# Altium project B219_BMD-340_carrier_small.PrjPcb
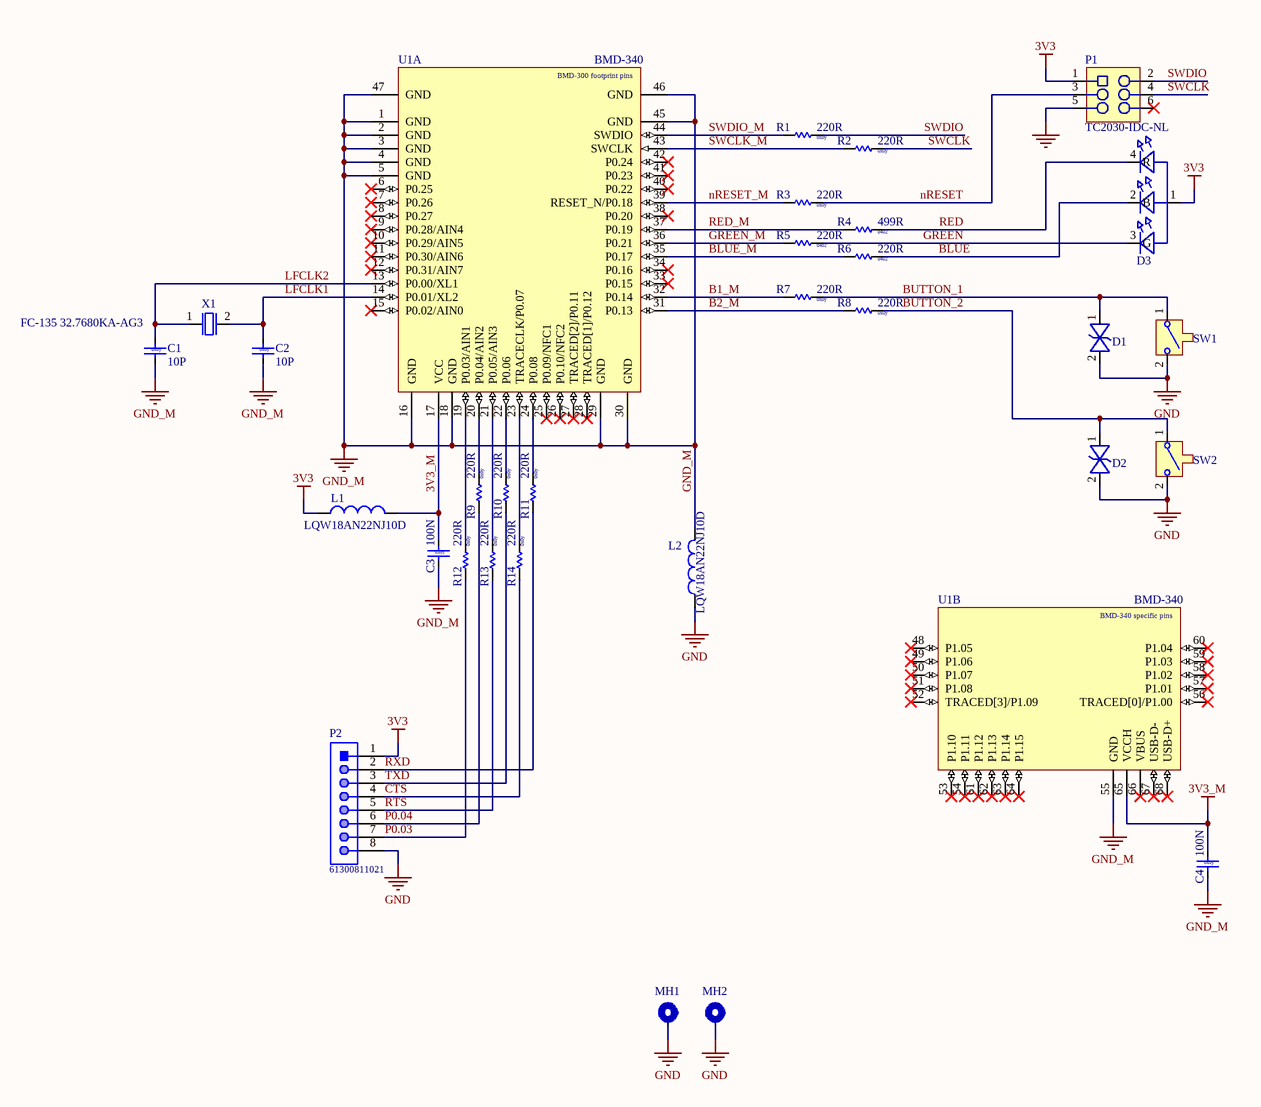
[diagram p0: B219.SchDoc]
GlobalClientName: u-blox; GlobalProjectLink: www.u-blox.com; GlobalProjectName: TE_SUP_ANT; GlobalProjectRevision: A; GlobalProjectTeam: u-blox AG; GlobalReleaseDate: 2020-10-23; PCBDocNum: B219; PCBName: B219 BMD-340 CS; ProjectEngineer: BREC; ReleaseBy1: BREC; ReleaseBy2: -; ReleaseBy3: -; ReleaseDate1: 2020-10-23; ReleaseDate2: -; ReleaseDate3: -; ReleaseDesc1: Initial Release; ReleaseDesc2: -; ReleaseDesc3: -; ReleaseRev1: A; ReleaseRev2: -; ReleaseRev3: -; SchDocNum: B219; SchSheetTotal: 1
1 sheet, 33 parts. Net scope: global (net labels, ports and power ports of the same name join across sheets).
Board file: B219.PcbDoc

## Sheet B219.SchDoc: Sheet Name
size B; Website: www.rigado.com; SheetTitle: Sheet Title; DrawnBy: Your Name; SheetNumber: 1; SheetTotal: X; SheetSize: B

### Parts
(Parts that share a designator on the sheet are numbered #1, #2 ... from top to bottom, then left to right.)
?#1  (no value)  (graphical)
?#2  (no value)  (graphical)
C1  value 10P  Size: 0x0y  [Cap 0402]
C2  value 10P  Size: 0x0y  [Cap 0402]
C3  value 100N  Size: 0x0y  [Cap 0402]
C4  value 100N  Size: 0x0y  [Cap 0402]
D1  (no value)  [SOD-923]
D2  (no value)  [SOD-923]
D3  (no value)  [4-PLCC]
L1  LQW18AN22NJ10D  [INDC1608X100X30LL20T10]
L2  LQW18AN22NJ10D  [INDC1608X100X30LL20T10]
MH1  MH_M1.5DNP  [MH_M1.5]  (value not drawn)
MH2  MH_M1.5DNP  [MH_M1.5]  (value not drawn)
P1  TC2030-IDC-NLDNP  [TC2030-IDC-NL]  (value not drawn)
P2  61300811021  [61300811021]
R1  value 220R  Size: 0x0y  [RES 0402 HD]
R2  value 220R  Size: 0x0y  [RES 0402 HD]
R3  value 220R  Size: 0x0y  [RES 0402 HD]
R4  value 499R  Size: 0402  [RES 0402 HD]
R5  value 220R  Size: 0402  [RES 0402 HD]
R6  value 220R  Size: 0402  [RES 0402 HD]
R7  value 220R  Size: 0x0y  [RES 0402 HD]
R8  value 220R  Size: 0x0y  [RES 0402 HD]
R9  value 220R  Size: 0x0y  [RES 0402 HD]
R10  value 220R  Size: 0x0y  [RES 0402 HD]
R11  value 220R  Size: 0x0y  [RES 0402 HD]
R12  value 220R  Size: 0x0y  [RES 0402 HD]
R13  value 220R  Size: 0x0y  [RES 0402 HD]
R14  value 220R  Size: 0x0y  [RES 0402 HD]
SW1  (no value)  [B3U-1000P]
SW2  (no value)  [B3U-1000P]
U1  (no value)  [BMD_LGA68S_1500X1020X190_PCB]  (parts A,B of 2)
X1  Manufacturer P/N: FC-135 32.7680KA-AG3  [XTAL_3215]

### Nets
3V3: D3.1(A) L1.1 P1.1 P2.1
3V3_M: C3.1 C4.1 L1.2 U1.17(VCC) U1.65(VCCH)
GND: D1.2 D2.2 L2.1 MH1.1 MH2.1 P1.5 P2.8 SW1.2 SW2.2
GND_M: C1.2 C2.2 C3.2 C4.2 L2.2 U1.1(GND) U1.2(GND) U1.3(GND) U1.4(GND) U1.5(GND) U1.16(GND) U1.18(GND) U1.29(GND) U1.30(GND) U1.45(GND) U1.46(GND) U1.47(GND) U1.55(GND)
B1_M: R7.1 U1.32(P0.14)
B2_M: R8.1 U1.31(P0.13)
BLUE: D3.2(B) R6.2
BLUE_M: R6.1 U1.35(P0.17)
BUTTON_1: D1.1 R7.2 SW1.1
BUTTON_2: D2.1 R8.2 SW2.1
CTS: P2.4 R14.1
GREEN: D3.3(G) R5.2
GREEN_M: R5.1 U1.36(P0.21)
LFCLK1: C2.1 U1.14(P0.01/XL2) X1.2
LFCLK2: C1.1 U1.13(P0.00/XL1) X1.1
nRESET: P1.3 R3.2
nRESET_M: R3.1 U1.39(RESET_N/P0.18)
P0.03: P2.7 R12.1
P0.04: P2.6 R9.1
RED: D3.4(R) R4.2
RED_M: R4.1 U1.37(P0.19)
RTS: P2.5 R13.1
RXD: P2.2 R11.1
SWCLK: P1.4 R2.2
SWCLK_M: R2.1 U1.43(SWCLK)
SWDIO: P1.2 R1.2
SWDIO_M: R1.1 U1.44(SWDIO)
TXD: P2.3 R10.1
NetR9_2: R9.2 U1.20(P0.04/AIN2)
NetR10_2: R10.2 U1.22(P0.06)
NetR11_2: R11.2 U1.24(P0.08)
NetR12_2: R12.2 U1.19(P0.03/AIN1)
NetR13_2: R13.2 U1.21(P0.05/AIN3)
NetR14_2: R14.2 U1.23(TRACECLK/P0.07)

Not connected (* = marked no-connect by the designer): P1 6*; U1 6(P0.25)* 7(P0.26)* 8(P0.27)* 9(P0.28/AIN4)* 10(P0.29/AIN5)* 11(P0.30/AIN6)* 12(P0.31/AIN7)* 15(P0.02/AIN0)* 25(P0.09/NFC1)* 26(P0.10/NFC2)* 27(TRACED[2]/P0.11)* 28(TRACED[1]/P0.12)* 33(P0.15)* 34(P0.16)* 38(P0.20)* 40(P0.22)* 41(P0.23)* 42(P0.24)* 48(P1.05)* 49(P1.06)* 50(P1.07)* 51(P1.08)* 52(TRACED[3]/P1.09)* 53(P1.10)* 54(P1.11)* 56(TRACED[0]/P1.00)* 57(P1.01)* 58(P1.02)* 59(P1.03)* 60(P1.04)* 61(P1.12)* 62(P1.13)* 63(P1.14)* 64(P1.15)* 66(VBUS)* 67(USB-D-)* 68(USB-D+)*

### Notes on the sheet
- Rev.
- Description
- Revision
- Date
- By
- Prepared By
- Revision:
- CONFIDENTIAL
- Page:
- (in symbol BMD-340, part A) BMD-300 footprint pins
- (in symbol BMD-340, part B) BMD-340 specific pins

### Library data of the parts
?#1 = Top_Revision_Block: Release Revision History Block
?#2 = Top_Title_Block: Top level schematic title block for top level sheet
C1 C2 = UBXH01-0004114: CAP CER COG 0402; Manufacturer: Murata Manufacturing Company, Ltd.; Manufacturer P/N: GRM1555C1H100CZ01; Tolerance: 5%; Max Voltage: 25.0V; Max Current: None; Editor: martin.frauchiger; Env: ROHS; Permitted Use: Volume Products; Perferred: PREF; Mfg P/N Status: Obsolete; Mfg P/N Split: 0; Mfg P/N Released: Yes; Part Number: UBXH01-0004114; Max Power: None; Min Operating Temp: None; Max Operating Temp: None; Part Type: Capacitor; Released by: martin.frauchiger; Release Data: 2005-09-01 15:36:53; Single Source: None; Automotive: None; Critical: None; UBX Wiki: https://wiki.u-blox.com/bin/view/Operations/PartDetails?index=5225; RefDes: C; Mfg P/N Datasheet: None; Manufacturer 2: None; Manufacturer P/N 2: None; Mfg P/N Status 2: None; Mfg P/N Split 2: None; Mfg P/N Released 2: None; Mfg P/N Datasheet 2: None; Manufacturer 3: None; Manufacturer P/N 3: None; Mfg P/N Status 3: None; Mfg P/N Split 3: None; Mfg P/N Released 3: None; Mfg P/N Datasheet 3: None
C3 C4 = UBXH01-2021002: CAP CER X5R 0402; Manufacturer: Samsung Electro-Mechanics; Manufacturer P/N: CL05A104KP5NNN; Tolerance: 10%; Max Voltage: 10.0V; Max Current: None; Editor: roland.rust; Env: GREEN; Permitted Use: Volume Products; Perferred: PREF; Mfg P/N Status: Active; Mfg P/N Split: 0; Mfg P/N Released: Yes; Part Number: UBXH01-2021002; Max Power: None; Min Operating Temp: None; Max Operating Temp: None; Part Type: Capacitor; Released by: roland.rust; Release Data: 2005-07-22 13:59:44; Single Source: None; Automotive: None; Critical: None; UBX Wiki: https://wiki.u-blox.com/bin/view/Operations/PartDetails?index=5759; RefDes: C; Mfg P/N Datasheet: https://wiki.u-blox.com/bin/view/Generic/Docs/DocumentSummary?index=28113; Manufacturer 2: None; Manufacturer P/N 2: None; Mfg P/N Status 2: None; Mfg P/N Split 2: None; Mfg P/N Released 2: None; Mfg P/N Datasheet 2: None; Manufacturer 3: None; Manufacturer P/N 3: None; Mfg P/N Status 3: None; Mfg P/N Split 3: None; Mfg P/N Released 3: None; Mfg P/N Datasheet 3: None
D1 D2 = 110-00019: Diode, ESD9B, 3.3V, ST5G, SOD-923; Part Name: Diode TVS 3.3V SOD-923; Manufacturer: ON Semiconductor; Manufacturer P/N: ESD9B3.3ST5G; Item_Phase: Production; Body Size: 0.8mm x 0.6mm; Component Mounting Type: SMT; Diode Type: TVS; Use in new designs: Yes; Part Number: 110-00019; Part_Type: Diode; Revision: 0A; Supplier 1: Arrow; Supplier Part Number 1: ESD9B3.3ST5G; Arena Link: https://app.bom.com/a/4M5DJQ9Q9SR7DV4H?v=spec.summary; Height: 0.4mm; MFG Package: SOD-923; Package Type: SOD; Pins: 2; Voltage: 3.3V
D3 = 115-00011: LED, RGB Diffused SMT, PLCC4 4 Pin; Part Name: LED RGB SMT 2mm x 2mm; Manufacturer: Cree, Inc.; Manufacturer P/N: CLMVB-FKA-CFHEHLCBB7a363; Item_Phase: Production; Body Size: 2.0mm x 2.0mm; Current: 20mA Red, 10mA Green, 10mA, Blue; Number of Circuits: 3; Use in new designs: Yes; Vf: 2V Red, 3V Green, 3V Blue; Voltage: 5V; Part Number: 115-00011; Part_Type: LED; Revision: 0A; Supplier 1: Mouser; Supplier Part Number 1: 941-CLMVBFKACFHEHLCB; Arena Link: https://app.bom.com/a/UCV39GZGZIHY581D?v=spec.summary; Color: RGB; Component Mounting Type: SMT; Height: 1mm; MFG Package: PLCC4; Mounting Type: Vertical; Package Type: Custom; Pins: 4
L1 L2 = CMP-2000-06600-1: Chip Inductor, 22 nH, +/-5%, 640 mA, -55 to 125 degC, 0603 (1608 Metric), RoHS, Tape and Reel; Manufacturer: Murata; Frequency - Self Resonant: 3.2GHz; DC Resistance (DCR): 99mOhmMax; Online Catalog: LQWSeries; Frequency - Test: 100MHz; Material - Core: Non-Magnetic; Q @ Freq: 42@250MHz; Tolerance: ±5%; Shielding: Unshielded; Current Rating: 640mA; Type: Wirewound; Inductance: 22nH; Other Names: 490-6876-1; Product Training Modules: InductorProductsChipRFInductors; Category: Inductors,Coils,Chokes; Package Reference: 0603; Package Description: 2-Pin Surface Mount Device, Body 1.6 x 0.8 mm; Packaging: CutTape(CT); Series: LQW18A_10; Mounting Type: SurfaceMount; Datasheet Version: 11/2011; Size / Dimension: 0.063"Lx0.031"W(1.60mmx0.80mm); Manufacturer URL: http://www.murata.com/; Mounting Technology: SurfaceMount; Family: FixedInductors; Operating Temperature: -55°C~125°C; Height - Seated (Max): 0.039"(1.00mm); Package / Case: 0603(1608Metric); Standard Package: 1; Datasheet URL: http://search.murata.co.jp/Ceramy/image/img/PDF/ENG/L0075S0080LQW18A_10.pdf
MH1 MH2 = MH_M1.5: 1.5M screw mounting hole, plated; Added By: Jeremy D; Part Number: MH_M1.5; Size: 3.4mm x 3.4mm; Height: 0mm; Type: Mounting Hole; DNP: DNP; Added Date: 7/9/2015
P1 = TC2030-IDC-NL: CON PADS FOR CBL PLUG-OF-NAILS 6-PIN NO LEGS; Manufacturer: TAG Connect; Added By: Paul B; Manufacturer P/N: TC2030-IDC-NL; Part Number: TC2030-IDC-NL; Size: 6.731mm x 12.446mm; Height: 0; DNP: DNP; Added Date: 4/22/2015
P2 = CMP-1502-01075-1: THT Angled Pin Header WR-PHD, Pitch 2.54 mm, Single Row, 8 pins; Manufacturer: Wurth Electronics; Pin Number: 8; Rated Current: 3A; Working Voltage: 250VAC; Withstanding Voltage: 500VAC; Gender: Male; Contact Resistance: 20mOhm; Pitch: 2.54mm; Part Number: 61300811021; Publisher: WurthElektronik; Manufacturer URL: http://www.we-online.de; Row Number: Single; Datasheet URL: https://katalog.we-online.de/em/datasheet/6130xx11021.pdf; Orientation: Angled; Operating Temperature: -40to105degC; Mounting Technology: THT; Package Reference: 61300811021; Packaging: Bag; Manufacturer Part Number: 61300811021
R1-R3 R7-R14 = UBXH18-0008033: RES THICK FILM CHIP 0402; Manufacturer: YAGEO; Manufacturer P/N: 2322_705_87221_L; Tolerance: 5%; Max Voltage: None; Max Power: 100mW; Editor: roland.rust; Env: ROHS; Permitted Use: Volume Products; Perferred: PREF; Mfg P/N Status: NRND; Mfg P/N Split: 0; Mfg P/N Released: Yes; Part Number: UBXH18-0008033; Max Current: None; Min Operating Temp: None; Max Operating Temp: None; Part Type: Resistor; Released by: roland.rust; Release Data: 2009-04-24 14:36:39; Single Source: None; Automotive: None; Critical: None; UBX Wiki: https://wiki.u-blox.com/bin/view/Operations/PartDetails?index=6914; RefDes: R; Mfg P/N Datasheet: None; Manufacturer 2: None; Manufacturer P/N 2: None; Mfg P/N Status 2: None; Mfg P/N Split 2: None; Mfg P/N Released 2: None; Mfg P/N Datasheet 2: None; Manufacturer 3: None; Manufacturer P/N 3: None; Mfg P/N Status 3: None; Mfg P/N Split 3: None; Mfg P/N Released 3: None; Mfg P/N Datasheet 3: None
R4 = 180-00031: Resistor, 499ohm, 1%, 1/16W, 0402; Part Name: RES SMD 499 OHM 1% 1/16W 0402; Manufacturer: Rohm Semiconductor; Manufacturer P/N: MCR01MRTF4990; Item_Phase: Production; Component Mounting Type: SMT; Tolerance: +/- 1%; Use in new designs: Yes; Part Number: 180-00031; Part_Type: Resistor; Supplier 1: Digi-Key; Supplier Part Number 1: RHM499CDCT-ND; Manufacturer 2: Samsung Electro-Mechanics America, Inc; Manufacturer P/N 2: RC1005F4990CS; Arena Link: https://app.bom.com/a/Q8RZ5CVCVEDU1SS5?v=spec.summary; Height: 0.4mm; Pins: 2; Power: 1/16W; Revision: 0D; Supplier 2: Digi-Key; Supplier Part Number 2: 1276-3992-1-ND; Alternate Footprint Ref: RES 0402
R5 R6 = 180-00098: Resistor, 220ohm, 5%, 1/16W, 0402.; Part Name: RES SMD 220 OHM 5% 1/16W 0402; Manufacturer: Panasonic Electronic Components; Manufacturer P/N: ERJ-2GEJ221X; Item_Phase: Production; Component Mounting Type: SMT; Tolerance: +/- 5%; Use in new designs: Yes; Part Number: 180-00098; Part_Type: Resistor; Supplier 1: Digi-Key; Supplier Part Number 1: P220JCT-ND; Arena Link: https://app.bom.com/a/8Q9HNUDUDWVBJC30?v=spec.summary; Pins: 2; Power: 1/16W; Revision: 0C; Manufacturer 2: Samsung Electro-Mechanics America, Inc; Manufacturer P/N 2: RC1005J221CS; Supplier 2: Digi-Key; Supplier Part Number 2: 1276-4360-1-ND; Alternate Footprint Ref: RES 0402; Height: 0.4mm
SW1 SW2 = 135-00007: Button, Momentary SPST-NO, 0.05A, 12V, 3mm x 2.5mm; Part Name: SWITCH TACTILE SPST-NO 0.05A 12V; Manufacturer: Omron Electronics Inc-EMC Div; Item_Phase: Production; Component Mounting Type: SMT; Current: 50mA; Switch/Button Circuit: SPST; Switch/Button Function: Off-Mom; Use in new designs: Yes; Voltage: 12VDC; Part Number: 135-00007; Part_Type: Button; Revision: 0A; Manufacturer P/N: B3U-1000P; Supplier 1: Digi-Key; Supplier Part Number 1: SW1020CT-ND; Arena Link: https://app.bom.com/a/TBU28FYFYHGV5FQ0?v=spec.summary; Body Size: 3mm x 2.5mm; Height: 1.2mm; Pins: 2
U1 = BMD-340: u-blox BMD-340 Bluetooth 5 LE, 802.15.4 module; Manufacturer P/N: BMD-340-A-R; Body Size: 15mm x 10.2mm; Internal Antenna: PCB; Protocol: BT 5 LE, 802.15.4, 2.4GHz Proprietary; Manufacturer: u-blox; Height: 1.9mm; Part Number: BMD-340
X1 = 100-00005: XTAL, 2Pin, 32.768kHz, 7pF 20ppm; Part Name: XTAL 32.768kHz 7pF 20ppm 3215; Part_Type: Crystal/Oscillator; Manufacturer: Epson; Item_Phase: Production; Body Size: 3.2mm x 1.5mm; Component Mounting Type: SMT; MFG Package: 2-SMD; Use in new designs: Yes; Part Number: 100-00005; Revision: 0C; Supplier 1: Digi-Key; Supplier Part Number 1: SER4086CT-ND; Manufacturer 2: AVX Corporation; Manufacturer P/N 2: ST3215SB32768C0HPWBB; Supplier 2: Digi-Key; Supplier Part Number 2: 1253-1113-1-ND; Arena Link: https://app.bom.com/a/L3MU07Q7Q98O5PC8?v=spec.summary; CL: 7pF; Frequency: 32.768kHz; Frequency Tolerance: 20ppm; Height: 0.9mm; Pins: 2

## Assembly variants
B219_BMD-340_carrier_small: not fitted MH1 MH2 P1